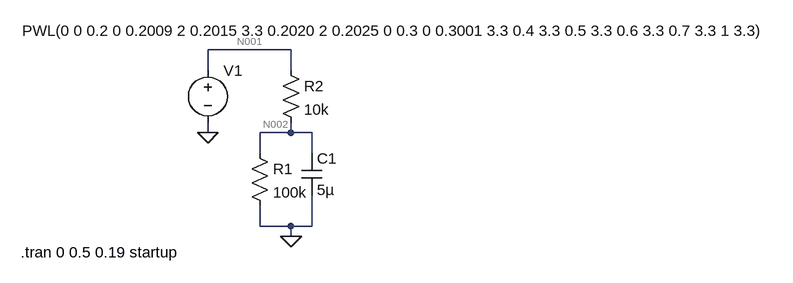
[diagram p0: schematic pushbutton-debounce-circuitry.asc]
pushbutton-debounce-circuitry.asc, the LTspice schematic file:
Version 4
SHEET 1 1036 680
WIRE 208 16 80 16
WIRE 80 48 80 16
WIRE 208 48 208 16
WIRE 80 144 80 128
WIRE 208 144 208 128
WIRE 208 144 160 144
WIRE 240 144 208 144
WIRE 160 176 160 144
WIRE 240 176 240 144
WIRE 160 288 160 256
WIRE 208 288 160 288
WIRE 240 288 240 240
WIRE 240 288 208 288
WIRE 208 304 208 288
FLAG 208 304 0
FLAG 80 144 0
SYMBOL res 144 160 R0
SYMATTR InstName R1
SYMATTR Value 100k
SYMBOL cap 224 176 R0
SYMATTR InstName C1
SYMATTR Value 5µ
SYMBOL res 192 32 R0
SYMATTR InstName R2
SYMATTR Value 10k
SYMBOL voltage 80 32 R0
WINDOW 3 -286 -45 Left 2
WINDOW 123 0 0 Left 0
WINDOW 39 0 0 Left 0
SYMATTR InstName V1
SYMATTR Value PWL(0 0 0.2 0 0.2009 2 0.2015 3.3 0.2020 2 0.2025 0 0.3 0 0.3001 3.3 0.4 3.3 0.5 3.3 0.6 3.3 0.7 3.3 1 3.3)
TEXT -208 328 Left 2 !.tran 0 0.5 0.19 startup

The netlist it stands for:
* pushbutton-debounce-circuitry.asc
R1 N002 0 100k
C1 N002 0 5µ
R2 N001 N002 10k
V1 N001 0 PWL(0 0 0.2 0 0.2009 2 0.2015 3.3 0.2020 2 0.2025 0 0.3 0 0.3001 3.3 0.4 3.3 0.5 3.3 0.6 3.3 0.7 3.3 1 3.3)
.tran 0 0.5 0.19 startup
.backanno
.end

* Results of the author's LTspice run, read from the files saved beside the schematic
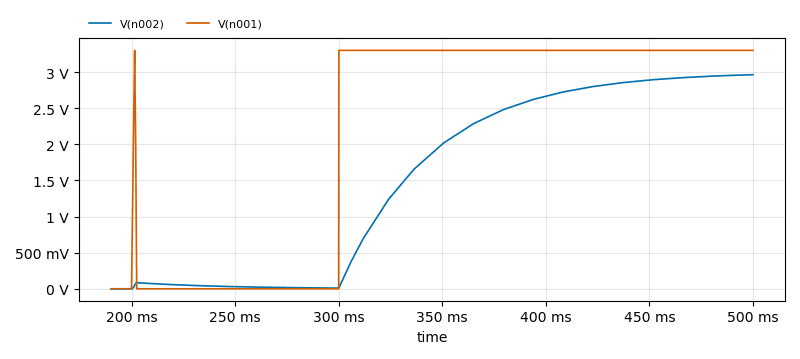
[diagram p1: Transient Analysis of pushbutton-debounce-circuitry.asc, plotted from the saved traces]
* Transient Analysis, 1 run:
*   V(n002): min 0 V, max 2.963 V, average 1.511 V, rms 1.964 V, last 2.963 V
*   V(n001): min 0 V, max 3.3 V, average 2.142 V, rms 2.656 V, last 3.3 V